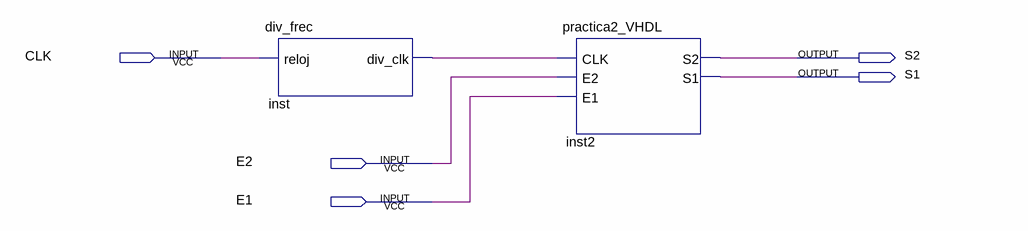
[diagram p0: schematic sheet]
// Quartus schematic P2_vhdl.bdf as structural Verilog: 2 symbols, 5 pins
module P2_vhdl (
  input  CLK,
  input  E2,
  input  E1,
  output S2,
  output S1
);

  wire inst_div_clk;

  div_frec inst (.reloj(CLK), .div_clk(inst_div_clk));
  practica2_VHDL inst2 (.CLK(inst_div_clk), .E2(E2), .E1(E1), .S2(S2), .S1(S1));
endmodule
